# Altium schematic sheet LeftBar3.SchDoc
size A4
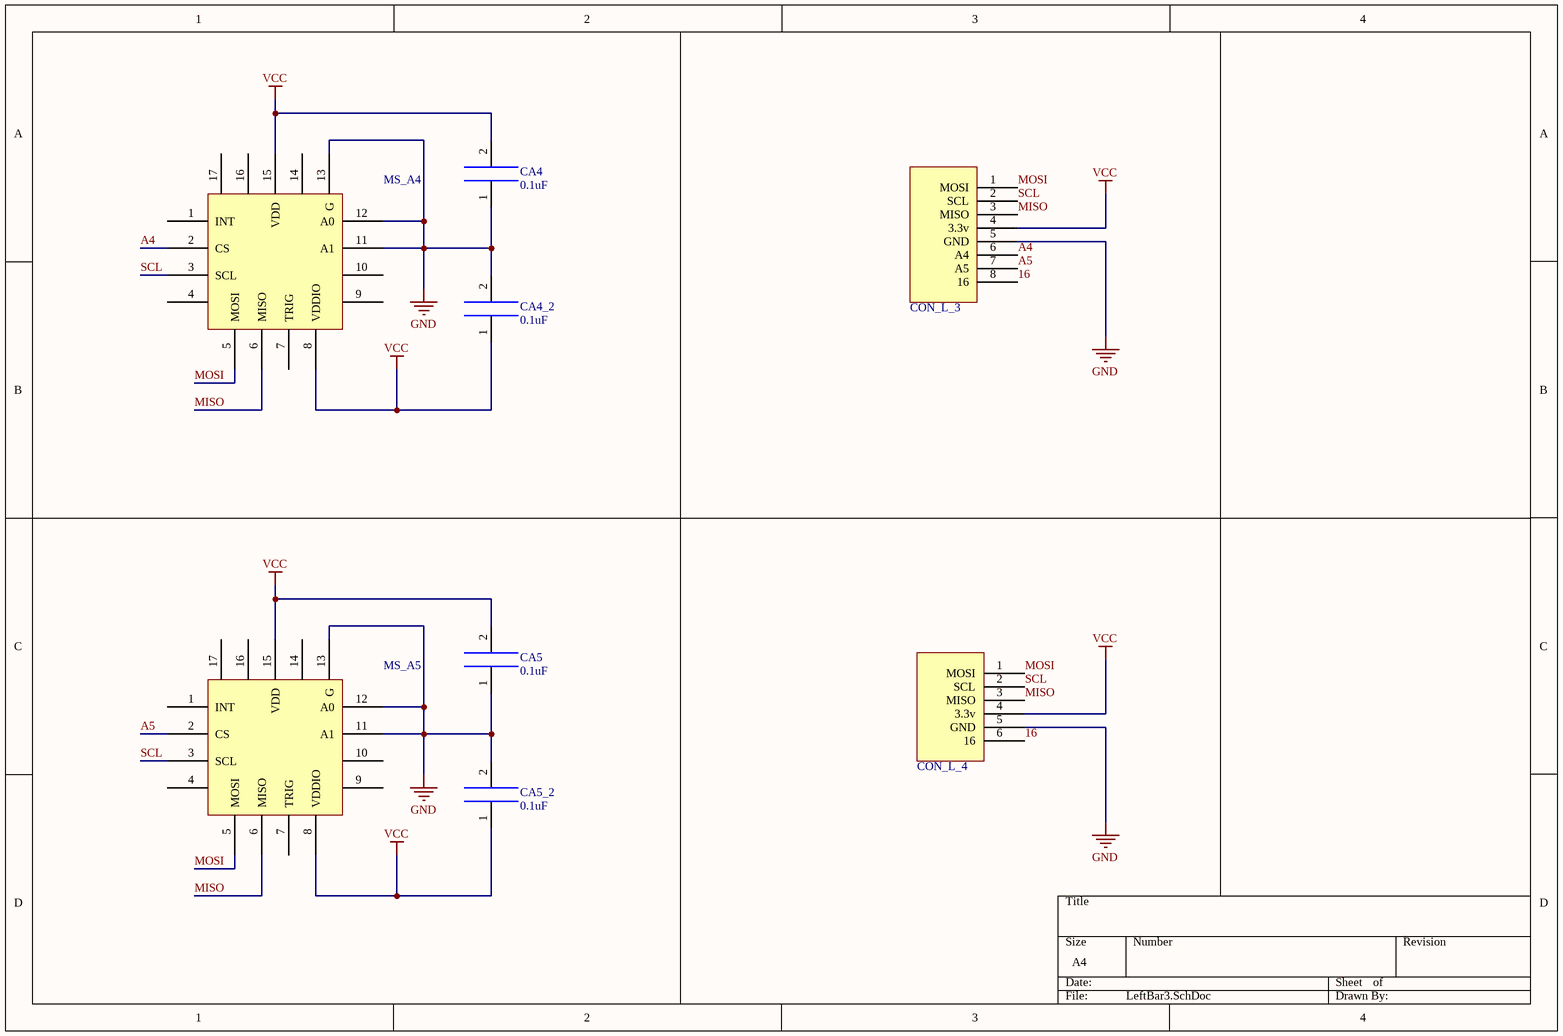
[diagram p0: LeftBar3.SchDoc]

## Parts
CA4  0.1uF  [CAP_0603]
CA4_2  0.1uF  [CAP_0603]
CA5  0.1uF  [CAP_0603]
CA5_2  0.1uF  [CAP_0603]
CON_L_3  PIN_left  [PIN_Left_3]  (value not drawn)
CON_L_4  PIN_left  [PIN_Left_4]  (value not drawn)
MS_A4  MLX90393SLW ABA 011 RE  [MLX90393]  (value not drawn)
MS_A5  MLX90393SLW ABA 011 RE  [MLX90393]  (value not drawn)

## Nets
GND: CA4.1 CA4_2.2 CA5.1 CA5_2.2 CON_L_3.5(GND) CON_L_4.5(GND) MS_A4.11(A1) MS_A4.12(A0) MS_A4.13(G) MS_A5.11(A1) MS_A5.12(A0) MS_A5.13(G)
VCC: CA4.2 CA4_2.1 CA5.2 CA5_2.1 CON_L_3.4(3.3v) CON_L_4.4(3.3v) MS_A4.8(VDDIO) MS_A4.15(VDD) MS_A5.8(VDDIO) MS_A5.15(VDD)
16: CON_L_3.8(16) CON_L_4.6(16)
A4: CON_L_3.6(A4) MS_A4.2(CS)
A5: CON_L_3.7(A5) MS_A5.2(CS)
MISO: CON_L_3.3(MISO) CON_L_4.3(MISO) MS_A4.6(MISO) MS_A5.6(MISO)
MOSI: CON_L_3.1(MOSI) CON_L_4.1(MOSI) MS_A4.5(MOSI) MS_A5.5(MOSI)
SCL: CON_L_3.2(SCL) CON_L_4.2(SCL) MS_A4.3(SCL) MS_A5.3(SCL)

Not connected (* = marked no-connect by the designer): MS_A4 1(INT) 4 7(TRIG) 9 10 14 16 17; MS_A5 1(INT) 4 7(TRIG) 9 10 14 16 17

## Library data of the parts
CA4 CA4_2 CA5 CA5_2 = CAP: Capacitance
CON_L_3 = PIN_left_3
CON_L_4 = PIN_left_4
MS_A4 MS_A5 = MLX90393SLW ABA 011 RE: MLX90393 Sensor